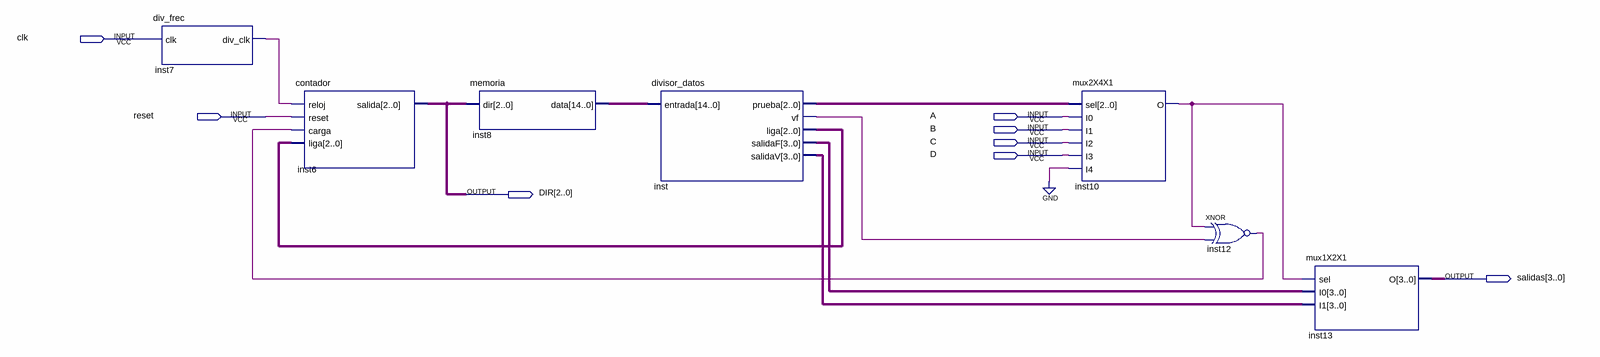
[diagram p0: schematic sheet]
// Quartus schematic practica5.bdf as structural Verilog: 7 symbols, 8 pins
module practica5 (
  input  clk,
  input  reset,
  input  A,
  input  B,
  input  C,
  input  D,
  output [2:0] DIR,
  output [3:0] salidas
);

  wire inst7_div_clk, inst10_o, inst12_out, inst_vf;
  wire [2:0] inst_liga, inst_prueba;
  wire [3:0] inst_salidaf, inst_salidav;
  wire [14:0] inst8_data;

  div_frec inst7 (.clk(clk), .div_clk(inst7_div_clk));
  contador inst6 (.reloj(inst7_div_clk), .reset(reset), .carga(inst12_out), .liga(inst_liga), .salida(DIR));
  memoria inst8 (.dir(DIR), .data(inst8_data));
  divisor_datos inst (
    .entrada(inst8_data), .prueba(inst_prueba), .vf(inst_vf), .liga(inst_liga), .salidaF(inst_salidaf),
    .salidaV(inst_salidav));
  mux2X4X1 inst10 (.sel(inst_prueba), .I0(A), .I1(B), .I2(C), .I3(D), .I4(1'b0), .O(inst10_o));
  xnor inst12 (inst12_out, inst10_o, inst_vf);
  mux1X2X1 inst13 (.sel(inst10_o), .I0(inst_salidaf), .I1(inst_salidav), .O(salidas));
endmodule
